# EAGLE design BLEmicro_IMU_ArduinoV3 (EAGLE 7.3.0)
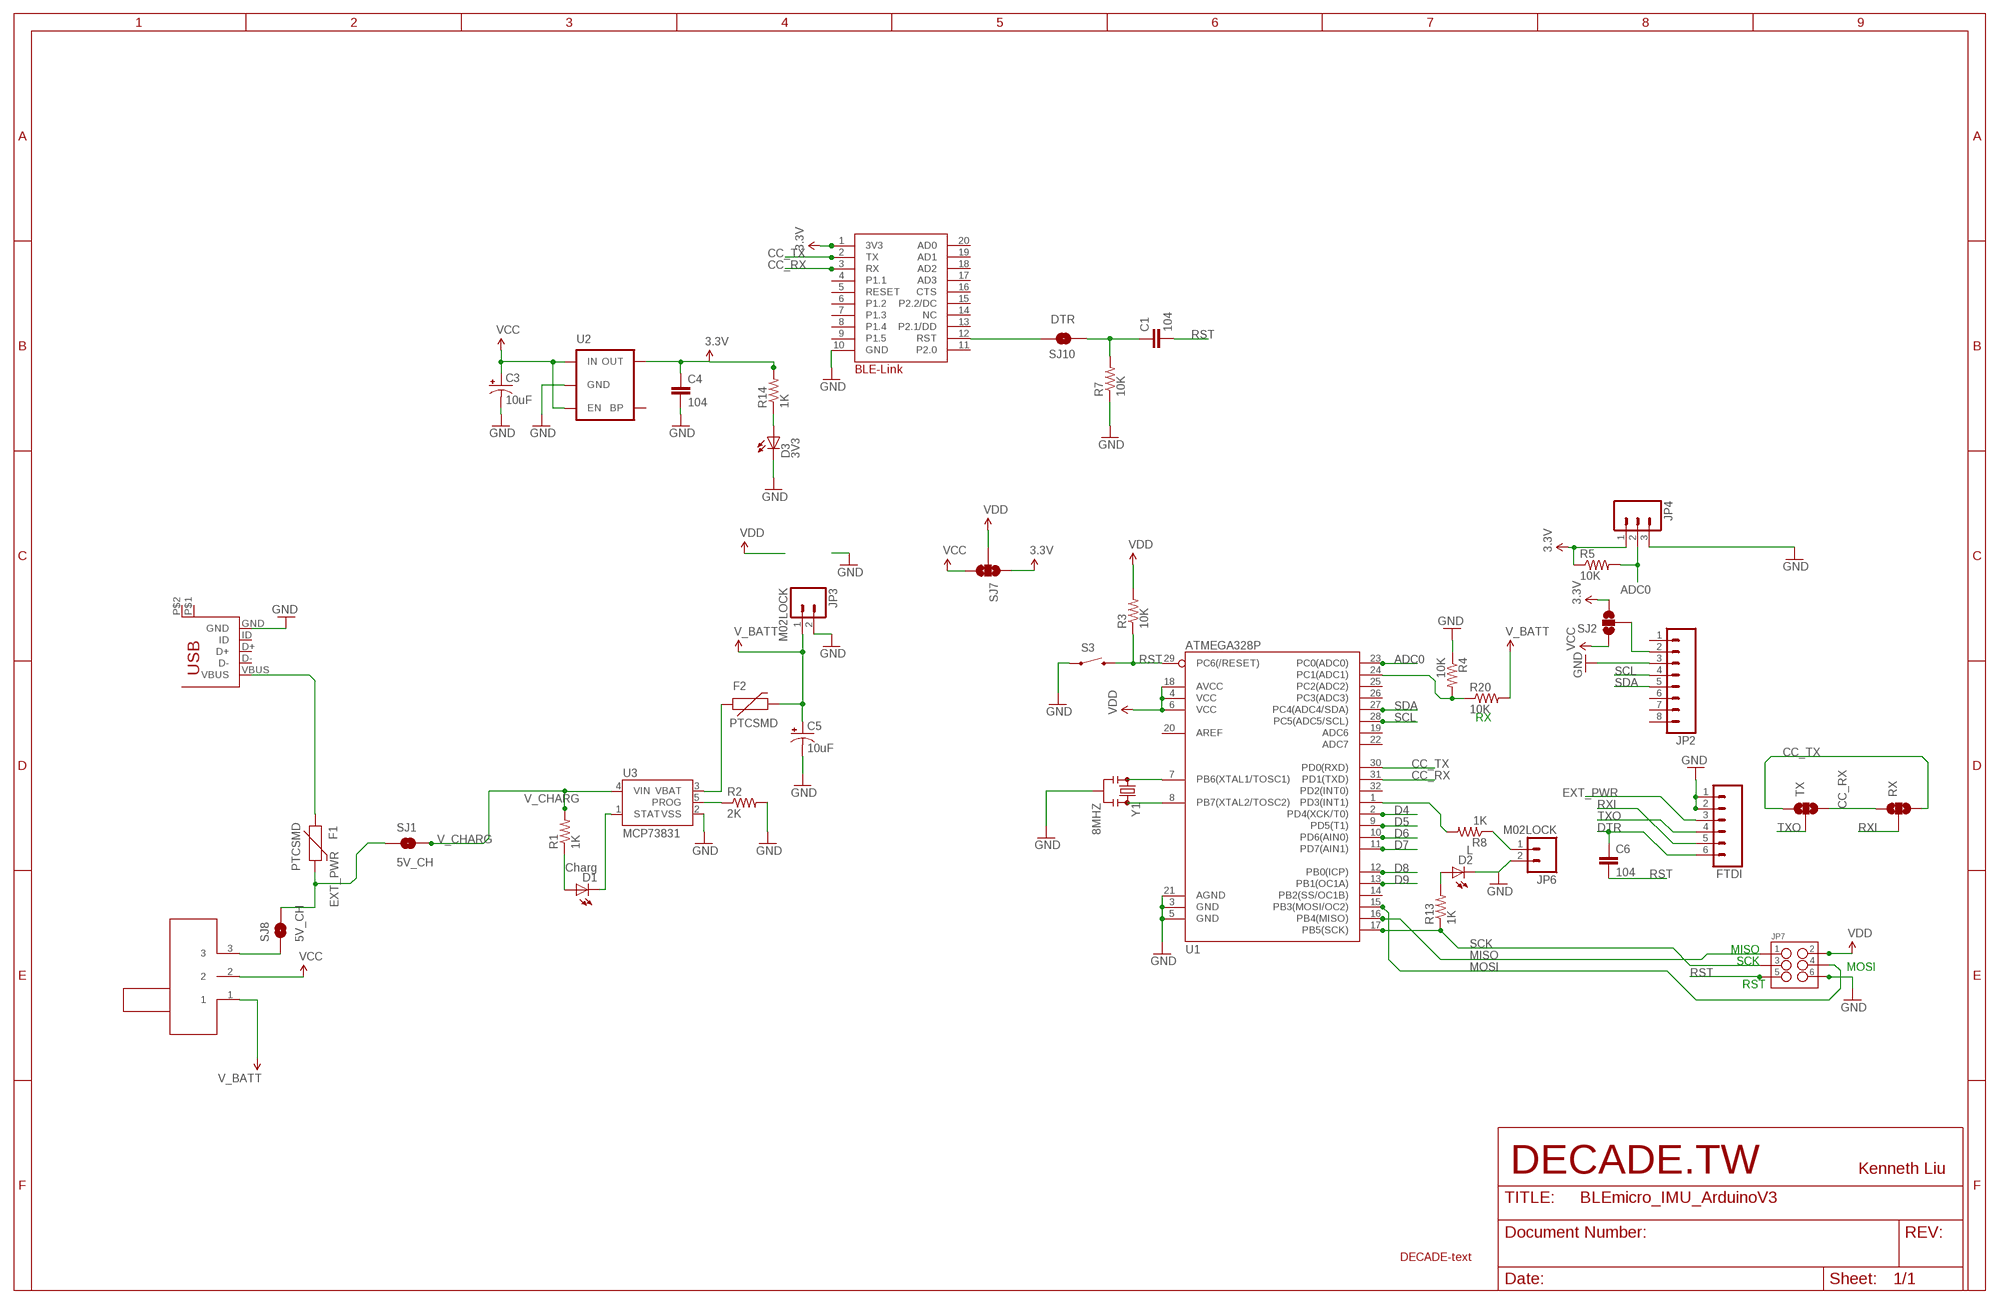
[diagram p0: schematic, sheet 1]

## Parts
C1  104  CAP0603-CAP  [0603-CAP]
C3  10uF  CAP_POL1206  [EIA3216]
C4  104  CAP0603-CAP  [0603-CAP]
C5  10uF  CAP_POL1206  [EIA3216]
C6  104  CAP0603-CAP  [0603-CAP]
D1  Charg  LED-RED0603  [LED-0603]
D2  L  LED-RED0603  [LED-0603]
D3  3V3  LED-RED0603  [LED-0603]
F1  PTCSMD  [PTC-1206]
F2  PTCSMD  [PTC-1206]
FTDI  M06NO_SILK  [1X06_NO_SILK]
JP2  M08NO_SILK  [1X08_NO_SILK]
JP3  M02LOCK  [1X02_LOCK]
JP4  M03PTH  [1X03]
JP6  M02LOCK  [1X02_LOCK]
JP7  M03X2NO_SILK  [2X3-NS]
R1  1K  RESISTOR0603-RES  [0603-RES]
R2  2K  RESISTOR0603-RES  [0603-RES]
R3  10K  RESISTOR0603-RES  [0603-RES]
R4  10K  RESISTOR0603-RES  [0603-RES]
R5  10K  RESISTOR0603-RES  [0603-RES]
R7  10K  RESISTOR0603-RES  [0603-RES]
R8  1K  RESISTOR0603-RES  [0603-RES]
R13  1K  RESISTOR0603-RES  [0603-RES]
R14  1K  RESISTOR0603-RES  [0603-RES]
R20  10K  RESISTOR0603-RES  [0603-RES]
RX  SOLDERJUMPER_2WAYS  [SJ_3]
S3  SWITCH-MOMENTARY-2SMD-1101NE  [TACTILE-SWITCH-1101NE]
SJ1  5V_CH  SOLDERJUMPER-OLDNC  [SJ_2S]
SJ2  SOLDERJUMPER_2WAYS  [SJ_3]
SJ7  SOLDERJUMPER_2WAYS  [SJ_3]
SJ8  5V_CH  SOLDERJUMPER-OLDNC  [SJ_2S]
SJ10  DTR  SOLDERJUMPER-OLDNC  [SJ_2S]
TX  SOLDERJUMPER_2WAYS  [SJ_3]
U1  ATMEGA328P  ATMEGA328_SMT  [TQFP32-08]
U2  MIC52053.3V  [SOT23-5]
U3  MCP73831  [SOT23-5]
U$1  BLE-LINK  [XBEE-1_LOCK]
U$2  USB_MICRO_7PIN  [USB-MICROB-7PIN]
U$4  DECADE-SW-SMALL  [DECADE-SW-SM]
U$7  DECADE-LOGO-TEXT  [DECADE-LOGO-TEXT]
Y1  8MHZ  RESONATOR8MHZ  [RESONATOR-SMD]

## Nets
3.3V: C4.1 JP4.1 R5.1 R14.2 SJ2.3 SJ7.1 U2.5(OUT) U$1.1(3V3)
ADC0: JP4.2 R5.2 U1.23(PC0(ADC0))
CC_RX: RX.1 TX.3 U1.31(PD1(TXD)) U$1.3(RX)
CC_TX: RX.3 TX.1 U1.30(PD0(RXD)) U$1.2(TX)
D4: U1.2(PD4(XCK/T0))
D5: U1.9(PD5(T1))
D6: U1.10(PD6(AIN0))
D7: U1.11(PD7(AIN1))
D8: U1.12(PB0(ICP))
D9: U1.13(PB1(OC1A))
DTR: C6.1 FTDI.6
EXT_PWR: F1.2 FTDI.3 SJ1.1 SJ8.2
GND: C3.C(-) C4.2 C5.C(-) D2.C D3.C FTDI.1 FTDI.2 JP2.3 JP3.2 JP4.3 JP6.2 JP7.6 R2.2 R4.1 R7.1 S3.1 U1.3(GND) U1.5(GND) U1.21(AGND) U2.2(GND) U3.2(VSS) U$1.10(GND) U$2.GND Y1.2
MISO: JP7.1 U1.16(PB4(MISO))
MOSI: JP7.4 U1.15(PB3(MOSI/OC2))
N$1: U1.7(PB6(XTAL1/TOSC1)) Y1.1
N$2: U1.8(PB7(XTAL2/TOSC2)) Y1.3
N$3: D1.C U3.1(STAT)
N$4: D1.A R1.1
N$5: F1.1 U$2.VBUS
N$6: R2.1 U3.5(PROG)
N$7: F2.1 U3.3(VBAT)
N$8: D2.A R13.2
N$11: D3.A R14.1
N$14: C1.1 R7.2 SJ10.1
N$16: SJ8.1 U$4.3
N$20: JP2.2 SJ2.2
N$21: R8.2 U1.1(PD3(INT1))
N$22: JP6.1 R8.1
N$33: R4.2 R20.1 U1.24(PC1(ADC1))
N$37: SJ10.2 U$1.12(RST)
RST: C1.2 C6.2 JP7.5 R3.1 S3.2 U1.29(PC6(/RESET))
RXI: FTDI.5 RX.2
SCK: JP7.3 R13.1 U1.17(PB5(SCK))
SCL: JP2.4 U1.28(PC5(ADC5/SCL))
SDA: JP2.5 U1.27(PC4(ADC4/SDA))
TXO: FTDI.4 TX.2
V_BATT: C5.A(+) F2.2 JP3.1 R20.2 U$4.1
V_CHARG: R1.2 SJ1.2 U3.4(VIN)
VCC: C3.A(+) SJ2.1 SJ7.3 U2.1(IN) U2.3(EN) U$4.2
VDD: JP7.2 R3.2 SJ7.2 U1.4(VCC) U1.6(VCC) U1.18(AVCC)
Unconnected: JP2.1 JP2.6 JP2.7 JP2.8 U1.14(PB2(SS/OC1B)) U1.19(ADC6) U1.20(AREF) U1.22(ADC7) U1.25(PC2(ADC2)) U1.26(PC3(ADC3)) U1.32(PD2(INT0)) U2.4(BP) U$1.4(P1.1) U$1.5(RESET) U$1.6(P1.2) U$1.7(P1.3) U$1.8(P1.4) U$1.9(P1.5) U$1.11(P2.0) U$1.13(P2.1/DD) U$1.14(NC) U$1.15(P2.2/DC) U$1.16(CTS) U$1.17(AD3) U$1.18(AD2) U$1.19(AD1) U$1.20(AD0) U$2.D+ U$2.D- U$2.ID U$2.P$1 U$2.P$2

## Notes on the sheet
- RX
- MISO
- SCK
- MOSI
- RST
- DECADE.TW | Kenneth Liu

## Library data of the parts
C1 C4 C6 = SparkFun-Capacitors:CAP: Capacitor Standard 0603 ceramic capacitor, and 0.1" leaded capacitor.
C3 C5 = SparkFun-Capacitors:CAP_POL: Capacitor Polarized These are standard SMD and PTH capacitors. Normally 10uF, 47uF, and 100uF in electrolytic and tantalum varieties. Always verify the external diameter of the through hole cap, it varies with capacity, voltage, and manufacturer. The EIA devices should be standard.
D1-D3 = SparkFun-LED:LED-RED: Assorted Red LEDs LilyPad 1206- DIO-09912 1206- DIO-00809 0603- DIO-00819; PROD_ID: DIO-00819; VALUE: RED
F1 F2 = SparkFun-PowerIC:PTC: Resettable Fuse PTC Resettable Fuse. Spark Fun Electronics SKU : COM-08357; PROD_ID: RES-11150
FTDI = SparkFun-Connectors:M06: Header 6 Standard 6-pin 0.1" header. Use with straight break away headers (SKU : PRT-00116), right angle break away headers (PRT-00553), swiss pins (PRT-00743), machine pins (PRT-00117), and female headers (PRT-00115). Molex polarized connector foot print use with SKU : PRT-08094 with associated crimp pins and housings. NOTES ON THE VARIANTS LOCK and LOCK_LONGPADS... This footprint was designed to help hold the alignment of a through-hole component (i.e. 6-pin header) while soldering it into place. You may notice that each hole has been shifted either up or down by 0.005 of an inch from it's more standard position (which is a perfectly straight line). This slight alteration caused the pins (the squares in the middle) to touch the edges of the holes. Because they are alternating, it causes a "brace" to hold the component in place. 0.005 has proven to be the perfect amount of "off-center" position when using our standard breakaway headers. Although looks a little odd when you look at the bare footprint, once you have a header in there, the alteration is very hard to notice. Also,if you push a header all the way into place, it is covered up entirely on the bottom side. This idea of altering the position of holes to aid alignment will be further integrated into the Sparkfun Library for other footprints. It can help hold any component with 3 or more connection pins.
JP2 = SparkFun-Connectors:M08: Header 8 Standard 8-pin 0.1" header. Use with straight break away headers (SKU : PRT-00116), right angle break away headers (PRT-00553), swiss pins (PRT-00743), machine pins (PRT-00117), and female headers (PRT-00115).
JP3 JP6 = SparkFun-Connectors:M02: Standard 2-pin 0.1" header. Use with - straight break away headers ( PRT-00116) - right angle break away headers (PRT-00553) - swiss pins (PRT-00743) - machine pins (PRT-00117) - female headers (PRT-00115) Molex polarized connector foot print use with: PRT-08233 with associated crimp pins and housings. 2.54_SCREWTERM for use with PRT-10571. 3.5mm Screw Terminal footprints for PRT-08084 5mm Screw Terminal footprints for use with PRT-08433
JP4 = SparkFun-Connectors:M03: Header 3 Standard 3-pin 0.1" header. Use with straight break away headers (SKU : PRT-00116), right angle break away headers (PRT-00553), swiss pins (PRT-00743), machine pins (PRT-00117), and female headers (PRT-00115). Molex polarized connector foot print use with SKU : PRT-08232 with associated crimp pins and housings.
JP7 = DECADE-libraries20150915:M03X2: 2x3 .1" header. Shrouded, with keying- CONN-10681 SMT- CONN-11415 Pogo pins- HW-11044
R1-R5 R7 R8 R13 R14 R20 = SparkFun-Passives:RESISTOR: Resistor Basic schematic elements and footprints for 0603, 1206, and PTH resistors.
RX SJ2 SJ7 TX = SparkFun-Passives:SOLDERJUMPER_2WAY: Solder Jumper 2 way solder jumper
S3 = SparkFun-Electromechanical:SWITCH-MOMENTARY-2: Various NO switches- pushbuttons, reed, etc; PROD_ID: SWCH-00815
SJ1 SJ8 SJ10 = SparkFun-Passives:SOLDERJUMPER-OLD: Solder Jumper Standard SMD solder jumper. Used to automate production. Two varients : Normally Open and Normally Closed are the same, but have different paste layers. NC will have a large amount of paste and should jumper during reflow.
U1 = SparkFun-DigitalIC:ATMEGA328_SMT: 32-Pin Atmega328 part Commonly used on Arduino compatible boards Available in QFP and QFN packages TQFP is IC-09069 QFN is non-stock; PROD_ID: IC-09069
U2 = SparkFun-PowerIC:MIC5205: MIC5205 150mA vreg 3.3V - VREG-00822 5V - VREG-00823; PROD_ID: VREG-00822
U3 = SparkFun-PowerIC:MCP73831: Miniature single cell, fully integrated Li-Ion, Li-polymer charge management controller http://ww1.microchip.com/downloads/en/DeviceDoc/21984a.pdf IC-09995; PROD_ID: IC-09995
U$1 = SparkFun-RF:BLE-LINK
U$2 = DECADE-libraries20151103:USB_MICRO_7PIN
U$4 = DECADE-libraries:DECADE-SW-SMALL
U$7 = DECADE-libraries:DECADE-LOGO-TEXT
Y1 = SparkFun-FreqCtrl:RESONATOR: Resonator Small SMD resonator. Used, eg, on the Arduino Pro/ Pro Mini boards. 8MHz- XTAL-08895 16MHz- XTAL-08900; PROD_ID: XTAL-08895

## Board
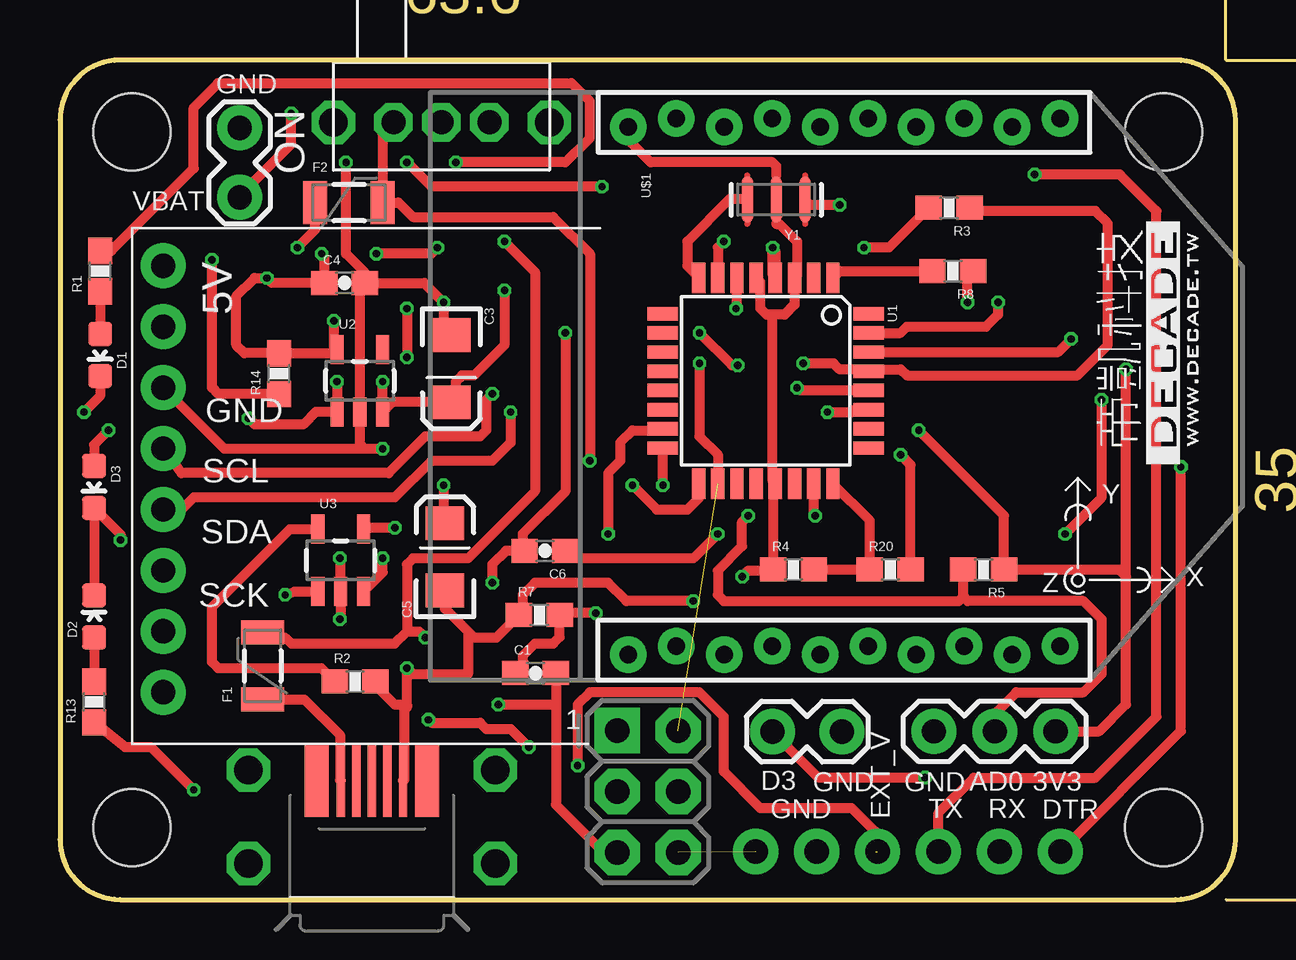
[diagram p1: board, top side]
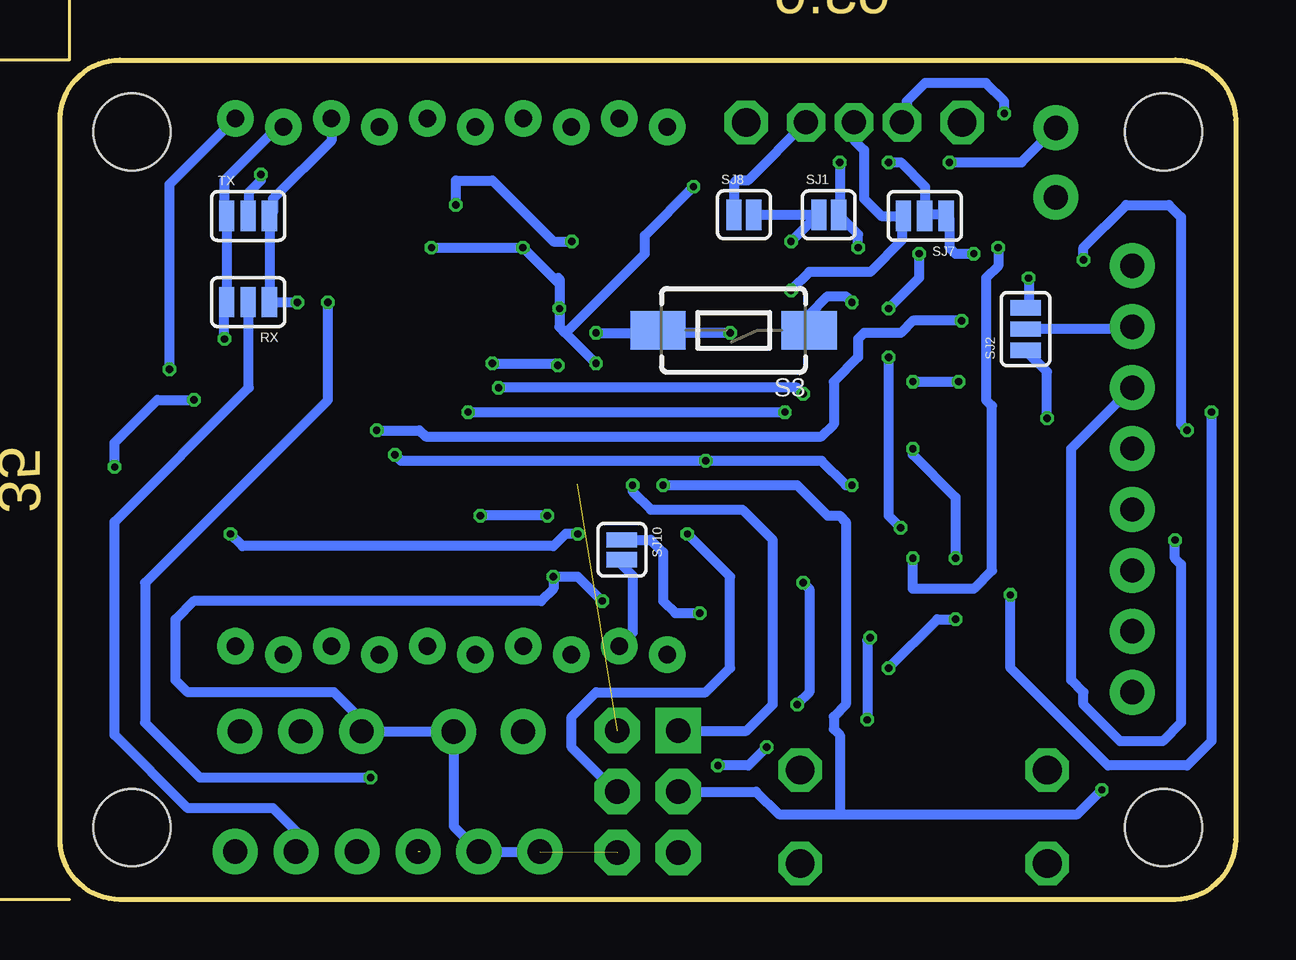
[diagram p2: board, bottom side, seen from below]

Size 49 x 35 mm. Coordinates in mm from the lower left corner, seen from the top.
Outline: 2.5,0 46.5,0 arc90 49,2.5 49,32.5 arc90 46.5,35 2.5,35 arc90 0,32.5 0,2.5 arc90 2.5,0
Copper layers (1*16): Top 0.035mm / dielectric 1.5mm / Bottom 0.035mm
Design rules "ChinaPCB-2015-16mil *": minimum track width 12mil, minimum drill 12mil, track to track 16mil, track to pad 16mil, pad to pad 16mil, via to via 16mil, smd to smd 10mil, copper to edge 10mil, drill to drill 15mil, minimum pad ring 12mil, minimum via ring 5mil, stop-mask expansion 4mil, vias tented up to drill 12mil, thermal gap 10mil
Holes 3.2 mm at 46,32 46,3 3,32 3,3
Milling: area 51.7,0 to 52.3,1.5; area 51.7,33.5 to 52.3,35; area 49.8,16.1 to 51.6,18.9; area 47.1,38.8 to 48.6,39.4; area -15,38.8 to -13.5,39.4; area 14,36.9 to 19.6,38.7; 6 lines

### Footprints (pad centres in the part's own frame; a part is rotated, then mirrored left to right if it is on the bottom)
0603-CAP = smd 1.1 x 1: 1 -0.85,0; 2 0.85,0
EIA3216 = smd 1.4 x 1.6: A 1.4,0; C -1.4,0
LED-0603 = smd 1 x 1: A 0,-0.877; C 0,0.877
PTC-1206 = smd 1 x 1.8: 1 -1.4,0; 2 1.4,0
1X06_NO_SILK = drill 1.016 pad 1.88: 1 0,0; 2 2.54,0; 3 5.08,0; 4 7.62,0; 5 10.16,0; 6 12.7,0
1X08_NO_SILK = drill 1.016 pad 1.88: 1 0,0; 2 2.54,0; 3 5.08,0; 4 7.62,0; 5 10.16,0; 6 12.7,0; 7 15.24,0; 8 17.78,0
1X02_LOCK = drill 1.016 pad 1.88: 1 -0.178,0; 2 2.718,0
1X03 = drill 1.016 pad 1.88: 1 0,0; 2 2.54,0; 3 5.08,0
2X3-NS = drill 1.016 pad 1.88 square: 1 -2.54,-1.27 | drill 1.016 pad 1.88 octagon: 2 -2.54,1.27; 3 0,-1.27; 4 0,1.27; 5 2.54,-1.27; 6 2.54,1.27
0603-RES = smd 1.1 x 1: 1 -0.85,0; 2 0.85,0
SJ_3 = smd 0.635 x 1.27: 1 -0.889,0; 2 0,0; 3 0.889,0
TACTILE-SWITCH-1101NE = smd 2.3 x 1.6: 1 -3.15,0; 2 3.15,0
SJ_2S = smd 0.635 x 1.27: 1 -0.412,0; 2 0.412,0
TQFP32-08 = smd 1.27 x 0.559: 1 -4.293,2.8; 2 -4.293,2; 3 -4.293,1.2; 4 -4.293,0.4; 5 -4.293,-0.4; 6 -4.293,-1.2; 7 -4.293,-2; 8 -4.293,-2.8; 17 4.293,-2.8; 18 4.293,-2; 19 4.293,-1.2; 20 4.293,-0.4; 21 4.293,0.4; 22 4.293,1.2; 23 4.293,2; 24 4.293,2.8 | smd 0.559 x 1.27: 9 -2.8,-4.293; 10 -2,-4.293; 11 -1.2,-4.293; 12 -0.4,-4.293; 13 0.4,-4.293; 14 1.2,-4.293; 15 2,-4.293; 16 2.8,-4.293; 25 2.8,4.293; 26 2,4.293; 27 1.2,4.293; 28 0.4,4.293; 29 -0.4,4.293; 30 -1.2,4.293; 31 -2,4.293; 32 -2.8,4.293
SOT23-5 = smd 0.55 x 1.2: 1 -0.95,-1.3; 2 0,-1.3; 3 0.95,-1.3; 4 0.95,1.3; 5 -0.95,1.3
XBEE-1_LOCK = drill 0.737 pad 1.524: 1 -11.178,20; 2 -10.822,18; 3 -11.178,16; 4 -10.822,14; 5 -11.178,12; 6 -10.822,10; 7 -11.178,8; 8 -10.822,6; 9 -11.178,4; 10 -10.822,2; 11 11.178,2; 12 10.822,4; 13 11.178,6; 14 10.822,8; 15 11.178,10; 16 10.822,12; 17 11.178,14; 18 10.822,16; 19 11.178,18; 20 10.822,20
USB-MICROB-7PIN = smd 0.35 x 3: D+ 0,3.45; D- -0.65,3.45; GND 1.3,3.45; ID 0.65,3.45; VBUS -1.3,3.45 | drill 1.2 octagon: P$1 -5.15,3.9; P$2 5.15,3.9; P$4 -5.15,0; P$5 5.15,0 | smd 1 x 3: PAD1 -2.3,3.45; PAD2 2.3,3.45
DECADE-SW-SM = drill 1 octagon: 1 2.5,2; 2 4.5,2; 3 6.5,2 | drill 1.2 octagon: GND 0,2; GND2 9,2
RESONATOR-SMD = smd 0.45 x 1.905: 1 -1.2,0; 2 0,0; 3 1.2,0

### Placement (x,y rotation side)
C1  19.82,9.44 0 top
C3  16.31,22.13 270 top
C4  11.86,25.7 0 top
C5  16.05,14.28 90 top
C6  20.21,14.54 180 top
D1  1.68,22.7 180 top
D2  1.42,11.8 0 top
D3  1.42,17.2 180 top
F1  8.45,9.74 90 top
F2  12.05,29.06 0 top
FTDI  29,2 0 top
JP2  4.3,26.42 270 top
JP3  7.49,29.45 90 top
JP4  41.51,7.01 180 top
JP6  29.88,7 0 top
JP7  24.5,4.5 270 top
R1  1.68,26.2 90 top
R2  12.3,9.09 0 top
R3  37.06,28.84 180 top
R4  30.58,13.76 0 top
R5  38.5,13.76 180 top
R7  19.98,11.86 0 top
R8  37.22,26.2 180 top
R13  1.42,8.23 90 top
R14  9.13,21.93 90 top
R20  34.61,13.76 0 top
RX  41.16,24.91 180 bottom
S3  20.92,23.73 180 bottom
SJ1  16.95,28.55 0 bottom
SJ2  8.75,23.78 90 bottom
SJ7  12.95,28.5 180 bottom
SJ8  20.49,28.55 0 bottom
SJ10  25.58,14.58 270 bottom
TX  41.16,28.5 0 bottom
U1  29.42,21.62 270 top
U2  12.5,21.63 0 top
U3  11.7,14.14 0 top
U$1  21.69,21.39 270 top
U$2  13,1.5 0 top
U$4  11.4,30.4 0 top
U$7  47.81,18.14 90 top
Y1  29.86,29.18 180 top

### Tracks (layer width: path | path; a pad name or v marks a point on that pad's centre or on a via)
3.3V  (via drill 0.3)
  Top 0.406: JP4.1 43.32,7.01 44.44,8.13 44.44,13.46 | 44.44,13.46 v44.44,22.1 | 44.44,13.46 44.14,13.76 R5.1 39.35,16.01 v35.8,19.56 | v11.42,24.13 11.42,22.79 | v10.91,26.92 11.02,26.78 C4.1 8.83,25.7 v8.62,25.91 8.11,25.91 7.35,25.15 7.35,23.11 7.69,22.77 R14.2 11.4,22.77 11.42,22.79 | 11.42,22.79 U2.5
  Bottom 0.406: v44.44,22.1 44.44,29.82 U$1.1 | SJ7.1 11.92,28.35 11.92,27.18 11.67,26.92 v10.91,26.92 | v8.62,25.91 8.62,24.8 SJ2.3 8.66,24.67 8.62,24.64 | v11.42,24.13 13.45,24.13 13.96,23.62 15.48,23.62 15.73,23.37 15.73,22.61 16.75,21.59 16.75,19.81 17.26,19.3 33.77,19.3 34.02,19.56 v35.8,19.56
ADC0  (via drill 0.3)
  Top 0.406: JP4.2 38.97,7.74 39.86,8.64 42.66,8.64 43.42,9.4 43.42,11.68 42.66,12.45 37.83,12.45 37.65,12.63 | 37.65,12.63 R5.2 | 37.65,12.63 37.47,12.45 27.67,12.45 27.42,12.7 27.42,13.72 28.43,14.73 28.43,15.75 v28.69,16 | v31.48,16 31.42,16.06 U1.23
  Bottom 0.406: v28.69,16 v31.48,16
CC_RX  (via drill 0.3)
  Top 0.406: v39.1,24.89 39.1,24.38 38.59,23.88 35.29,23.88 35.04,23.62 U1.31
  Bottom 0.406: U$1.3 37.69,31.64 40.12,29.21 40.12,28.65 TX.3 RX.1 40.26,24.89 v39.1,24.89
CC_TX  (via drill 0.3)
  Top 0.406: U1.30 41.6,22.82 v42.15,23.37
  Bottom 0.406: U$1.2 39.91,32.21 42.15,29.97 42.15,28.6 TX.1 RX.3 42.15,24.8 v42.15,23.37
DTR  (via drill 0.3)
  Top 0.406: FTDI.6 46.72,7.02 v46.72,18.03 | v27.42,15.24 26.4,14.22 21.38,14.22 C6.1 | v41.9,15.24 43.42,16.76 v43.42,20.83
  Bottom 0.406: v27.42,15.24 27.93,15.24 28.43,14.73 41.39,14.73 v41.9,15.24 | v46.72,18.03 46.72,19.05 44.94,20.83 v43.42,20.83
EXT_PWR  (via drill 0.3)  (1 unrouted)
  Top 0.406: F1.2 8.67,10.92 9.38,10.92 9.64,10.67 13.96,10.67 14.46,11.18 | v18.53,27.43 19.8,26.16 19.8,17.02 17,14.22 14.72,14.22 14.46,13.97 14.46,11.18 | 33.99,2 33.99,2.83 33.01,3.81 29.2,3.81 27.67,5.33 27.67,7.62 26.66,8.64 22.08,8.64 21.58,8.13 v21.58,5.59 | v15.35,7.49 15.48,7.37 17.51,7.37 17.77,7.11 18.78,7.11 v19.54,6.35 | 14.46,11.18 14.97,11.18 v15.23,10.92
  Bottom 0.406: SJ8.2 SJ1.1 17.41,28.55 v18.53,27.43 | v15.23,10.92 15.35,10.79 v15.35,7.49 | v19.54,6.35 20.31,5.59 v21.58,5.59
GND  (via drill 0.3)  (1 unrouted)
  Top 0.406: v28.43,13.46 28.69,13.72 29.69,13.72 R4.1 29.73,17.23 U1.21 29.7,17.45 29.7,24.38 | v26.4,12.45 23.61,12.45 22.85,13.21 19.8,13.21 19.29,12.7 19.29,12.02 R7.1 | 18.95,11.68 R7.1 | 29.86,28.16 29.99,28.16 30.72,27.43 30.72,26.02 U1.3 30.62,24.79 30.21,24.38 29.7,24.38 | 29.7,24.38 29.45,24.38 29.2,24.64 29.2,25.74 U1.5 | D2.C D3.C 2.53,15.22 v2.53,14.99 | C3.C 15.99,23.86 v15.99,24.89 15.18,25.7 C4.2 | C5.C 16.05,12.13 17,11.18 | 17,11.18 17.26,10.92 18.19,10.92 R7.1 | 3.8,21.34 JP2.3 6.85,18.8 12.69,18.8 | 14.46,8.13 v14.46,9.65 14.72,9.4 17,9.4 17,11.18 | C4.2 12.5,25.49 U2.2 12.5,18.98 12.69,18.8 | C4.2 12.71,26.13 11.92,26.92 v11.92,30.73 | 14.46,8.13 14.46,8 14.34,7.96 14.34,4.95 U$2.GND | 12.69,18.8 v13.45,18.8 | R2.2 13.15,8.93 13.96,8.13 14.46,8.13 | v11.67,14.22 11.67,12.87 U3.2 11.7,11.71 v11.67,11.68 | 29.86,30.2 29.86,30.58 29.7,30.73 24.62,30.73 23.61,31.75 23.61,32.13 U$1.10
  Bottom 0.406: FTDI.1 FTDI.2 32.59,3.05 JP6.2 32.6,7.01 JP4.3 36.66,7.01 36.66,7.72 37.58,8.64 43.67,8.64 44.18,9.14 44.18,11.68 43.42,12.45 28.94,12.45 28.43,12.95 v28.43,13.46 27.42,13.46 v26.4,12.45 | S3.1 17.77,24.38 17,25.15 16.24,25.15 v15.99,24.89 | v14.46,9.65 12.43,11.68 v11.67,11.68 | v13.45,18.8 13.45,18.54 11.67,16.76 v11.67,14.22 | v11.92,30.73 8.93,30.73 JP3.2 | JP2.3 6.85,18.8 6.85,9.15 6.34,8.64 6.34,8.13 4.81,6.6 3.03,6.6 2.27,7.37 2.27,13.97 2.53,14.22 v2.53,14.99
MISO  (via drill 0.3)
  Top 0.406: v25.13,17.27 U1.16
  Bottom 0.406: JP7.1 20.38,7.04 19.29,8.13 19.29,14.99 20.56,16.26 24.37,16.26 25.13,17.02 v25.13,17.27
MOSI  (via drill 0.3)
  Top 0.406: U1.15 25.06,19.56 23.86,19.56 23.35,19.05 23.35,18.29 22.85,17.78 v22.85,15.24
  Bottom 0.406: JP7.4 25.82,4.5 27.67,6.35 27.67,7.62 26.66,8.64 22.08,8.64 21.07,9.65 21.07,13.46 v22.85,15.24
N$1  (via drill 0.3)
  Top 0.406: v32.5,28.96 31.28,28.96 Y1.1 | v27.67,27.43 27.42,27.18 U1.7
  Bottom 0.406: v32.5,28.96 32.5,29.97 30.97,29.97 28.43,27.43 v27.67,27.43
N$2
  Top 0.406: Y1.3 28.62,29.21 27.93,29.21 26.15,27.43 26.15,26.42 26.62,25.94 U1.8
N$3  (via drill 0.3)
  Top 0.406: D1.C 1.68,21 v1,20.32 | v9.38,12.7 9.78,12.84 U3.1
  Bottom 0.406: v1,20.32 1,6.6 2.02,5.59 5.32,5.59 9.38,9.65 v9.38,12.7
N$4
  Top 0.406: R1.1 D1.A
N$5
  Top 0.406: F1.1 10.18,8.34 11.67,6.86 11.67,4.98 U$2.VBUS
N$6
  Top 0.406: U3.5 9.59,15.44 6.34,12.19 6.34,9.91 6.59,9.65 10.89,9.65 R2.1
N$7  (via drill 0.3)
  Top 0.406: v9.89,27.18 10.64,27.93 F2.1 | U3.3 13.45,13.64 v13.45,14.22
  Bottom 0.406: v9.89,27.18 9.89,26.42 10.4,25.91 10.4,20.83 10.15,20.57 10.15,13.72 10.91,12.95 13.45,12.95 v13.45,14.22
N$8
  Top 0.406: D2.A R13.2
N$10
  Bottom 0.406: 12.81,28.57 12.18,28.57
N$11  (via drill 0.3)
  Top 0.406: R14.1 6.6,21.07 6.34,21.34 v6.34,26.67 | v2.02,19.56 1.42,18.96 D3.A
  Bottom 0.406: v6.34,26.67 6.34,27.18 4.56,28.96 2.78,28.96 2.27,28.45 2.27,19.81 v2.02,19.56
N$14  (via drill 0.3)
  Top 0.406: v22.34,11.94 20.91,11.94 R7.2 | R7.2 20.83,11.45 | C1.1 19.29,9.5 19.29,10.16 19.8,10.67 20.56,10.67 20.83,10.94 R7.2
  Bottom 0.406: SJ10.1 24.38,14.99 23.86,14.48 23.86,12.45 23.35,11.94 v22.34,11.94
N$16
  Bottom 0.406: U$4.3 20.33,29.97 20.81,29.97 20.9,29.88 SJ8.1
N$20
  Bottom 0.406: JP2.2 4.4,23.78 SJ2.2
N$21
  Top 0.406: U1.1 32.51,26.2 R8.2
N$22  (via drill 0.3)
  Top 0.406: v37.83,24.89 37.83,25.97 R8.1 | v36.05,5.08 31.62,5.08 JP6.1
  Bottom 0.406: v37.83,24.89 37.83,20.83 45.45,13.21 45.45,7.37 43.17,5.08 v36.05,5.08
N$33
  Top 0.406: R4.2 R20.1 33.76,15.79 U1.24
N$37
  Bottom 0.406: SJ10.2 25.69,14.06 25.13,13.51 25.13,11.12 U$1.12
RST  (via drill 0.3)
  Top 0.406: R3.1 38.05,28.7 43.17,28.7 43.67,28.19 43.67,23.11 42.4,21.84 35.29,21.84 35.04,22.1 33.79,22.1 U1.29 33.64,22.1 32.5,22.1 32.24,22.35 v30.97,22.35 | JP7.5 22.66,1.96 20.67,3.95 20.67,8.13 | v21.07,23.62 21.07,17.02 19.29,15.24 19.29,14.61 C6.2 18.59,14.54 18.02,13.97 v18.02,13.21 | C1.2 20.67,8.13 | v18.27,8.13 20.67,8.13 | v28.26,22.28 28,22.28 v26.66,23.62
  Bottom 0.406: v18.27,8.13 17.77,8.64 17.77,12.95 v18.02,13.21 | v26.66,23.62 24.18,23.62 S3.2 23.97,23.62 v21.07,23.62 | v30.97,22.35 28.33,22.35 v28.26,22.28
RXI
  Bottom 0.406: RX.2 41.13,24.88 41.13,21.34 46.72,15.75 46.72,6.86 43.67,3.81 40.12,3.81 39.16,2.85 FTDI.5
SCK  (via drill 0.3)
  Top 0.406: v5.57,4.57 3.8,6.35 2.71,6.35 R13.1 | v23.86,17.27 24.88,16.26 26.15,16.26 26.62,16.73 U1.17
  Bottom 0.406: JP7.3 19.98,4.5 19.04,3.56 16.5,3.56 | 16.5,3.56 6.59,3.56 v5.57,4.57 | v23.86,17.27 18.27,17.27 17,16 16.5,16 16.24,15.75 16.24,8.13 16.75,7.62 16.75,7.11 16.5,6.86 16.5,3.56
SCL  (via drill 0.3)
  Top 0.406: U1.28 30.86,21.22 v30.72,21.34 | JP2.4 5.07,17.78 13.7,17.78 15.23,19.3 17.51,19.3 17.77,19.56 17.77,20.83 v18.02,21.08
  Bottom 0.406: v30.72,21.34 18.27,21.34 v18.02,21.08
SDA  (via drill 0.3)
  Top 0.406: v18.78,20.32 18.78,19.05 18.02,18.29 15.48,18.29 13.96,16.76 5.57,16.76 5.07,16.26 JP2.5 | v31.99,20.32 33.01,20.32 33.11,20.42 U1.27
  Bottom 0.406: v31.99,20.32 v18.78,20.32
TXO  (via drill 0.3)
  Top 0.406: FTDI.4 36.62,3.61 38.09,5.08 43.17,5.08 45.71,7.62 45.71,28.7 44.18,30.23 v40.63,30.23
  Bottom 0.406: v40.63,30.23 40.63,29.97 41.13,29.46 41.13,28.52 TX.2
V_BATT  (via drill 0.3)
  Top 0.406: R20.2 35.46,18.12 v35.04,18.54 | v15.99,17.27 15.99,15.74 C5.A | U$4.1 13.45,31.95 F2.2 14.11,29.06 14.72,28.45 20.56,28.45 22.08,26.92 v22.08,18.29 | JP3.1 7.49,29.35 9.64,31.5 v9.64,32.77
  Bottom 0.406: v15.99,17.27 16.24,17.27 17.26,18.29 v22.08,18.29 34.78,18.29 v35.04,18.54 | v9.64,32.77 9.64,33.27 10.4,34.04 12.94,34.04 13.7,33.27 13.7,32.6 U$4.1
V_CHARG  (via drill 0.3)
  Top 0.406: v13.19,26.92 15.48,26.92 v15.73,27.18 | v14.46,24.64 v14.46,22.61 | v13.96,15.49 12.96,15.49 U3.4 | R1.2 2.14,27.05 5.57,30.48 5.57,33.02 6.59,34.04 21.32,34.04 22.08,33.27 22.08,31.75 21.07,30.73 v16.5,30.73
  Bottom 0.406: v13.19,26.92 13.19,25.91 v14.46,24.64 | v14.46,22.61 14.46,16 v13.96,15.49 | v16.5,30.73 16.5,28.59 SJ1.2 15.73,27.74 v15.73,27.18
VCC  (via drill 0.3)
  Top 0.406: v7.86,20.07 8.11,19.81 10.15,19.81 10.66,20.33 U2.1 v11.54,21.59 | v18.53,25.4 18.53,23.11 17.26,21.84 16.75,21.84 16.5,21.59 16.5,20.91 C3.A 13.86,20.73 U2.3 v13.45,21.59
  Bottom 0.406: 13.91,28.5 14.77,28.5 15.48,29.21 15.48,31.24 15.9,31.66 U$4.2 | v7.86,20.07 7.86,22 SJ2.1 8.66,22.89 8.62,22.86 | SJ7.3 13.91,28.5 | v18.53,25.4 17.77,26.16 15.23,26.16 13.91,27.48 13.91,28.5 | v13.45,21.59 v11.54,21.59
VDD  (via drill 0.3)  (1 unrouted)
  Top 0.406: R3.2 34.56,27.18 v33.51,27.18 | v28.18,24.64 28.22,24.68 U1.6 | v26.66,22.35 26.66,19.3 27.42,18.54 U1.18 | v22.59,29.72 15.48,29.72 v14.46,30.73 | v29.7,27.18 29.82,27.04 U1.4 29.7,26.03 v29.7,27.18
  Bottom 0.406: v33.51,27.18 v29.7,27.18 28.18,25.65 v28.18,24.64 | U1.6 28.18,25.88 v28.18,24.64 | v28.18,24.64 28.18,23.88 27.93,23.62 | v26.66,22.35 27.93,23.62 | 27.93,23.62 24.62,26.92 24.62,27.69 v22.59,29.72 | v14.46,30.73 13.96,30.73 12.94,29.72 SJ7.2

### Text on the board
tPlace: GND | ON | VBAT | 5V | GND | SCL | Y | SDA | Z | X | SCK | 1 | D3 | GND | GND | AD0 | 3V3 | GND | EXT_V | TX | RX | DTR